# EAGLE schematic bobis (EAGLE 6.5.0)
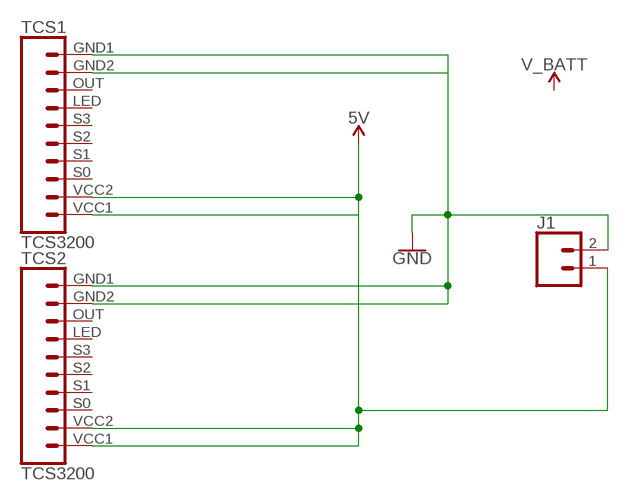
[diagram p0: schematic, sheet 1]

## Parts
J1  CONN_02  [1X02]
TCS1  TCS3200  [TCS3200]
TCS2  TCS3200  [TCS3200]

## Nets
5V: J1.1 TCS1.VCC1 TCS1.VCC2 TCS2.VCC1 TCS2.VCC2
GND: J1.2 TCS1.GND1 TCS1.GND2 TCS2.GND1 TCS2.GND2
Unconnected: TCS1.LED TCS1.OUT TCS1.S0 TCS1.S1 TCS1.S2 TCS1.S3 TCS2.LED TCS2.OUT TCS2.S0 TCS2.S1 TCS2.S2 TCS2.S3

## Library data of the parts
J1 = SparkFun-Connectors:CONN_02: Multi connection point. Often used as Generic Header-pin footprint for 0.1 inch spaced/style header connections On any of the 0.1 inch spaced packages, you can populate with these: Break Away Headers - Straight <https://www.sparkfun.com/products/116> (PRT-00116) Break Away Male Headers - Right Angle <https://www.sparkfun.com/products/553> (PRT-00553) Female Headers <https://www.sparkfun.com/products/115> (PRT-00115) Break Away Headers - Machine Pin <https://www.sparkfun.com/products/117> (PRT-00117) Break Away Female Headers - Swiss Machine Pin <https://www.sparkfun.com/products/743> (PRT-00743) For SCREWTERMINALS and SPRING TERMINALS visit here: Screw Terimnals on SparkFun.com <https://www.sparkfun.com/search/results?term=Screw+Terminals> (5mm/3.5mm/2.54mm spacing) This device is also useful as a general connection point to wire up your design to another part of your project. Our various solder wires solder well into these plated through hole pads. Hook-Up Wire - Assortment (Stranded, 22 AWG) <https://www.sparkfun.com/products/11375> (PRT-11375) Hook-Up Wire - Assortment (Solid Core, 22 AWG) <https://www.sparkfun.com/products/11367> (PRT-11367) View the entire wire category on our website here <https://www.sparkfun.com/categories/141> Special notes: Molex polarized connector foot print use with: PRT-08233 with associated crimp pins and housings. 2.54_SCREWTERM for use with PRT-10571. 3.5mm Screw Terminal footprints for PRT-08084 5mm Screw Terminal footprints for use with PRT-08432
TCS1 TCS2 = Robotica-IFRN-SC:TCS3200